# EAGLE design analog-frontend (EAGLE 6.6.0)
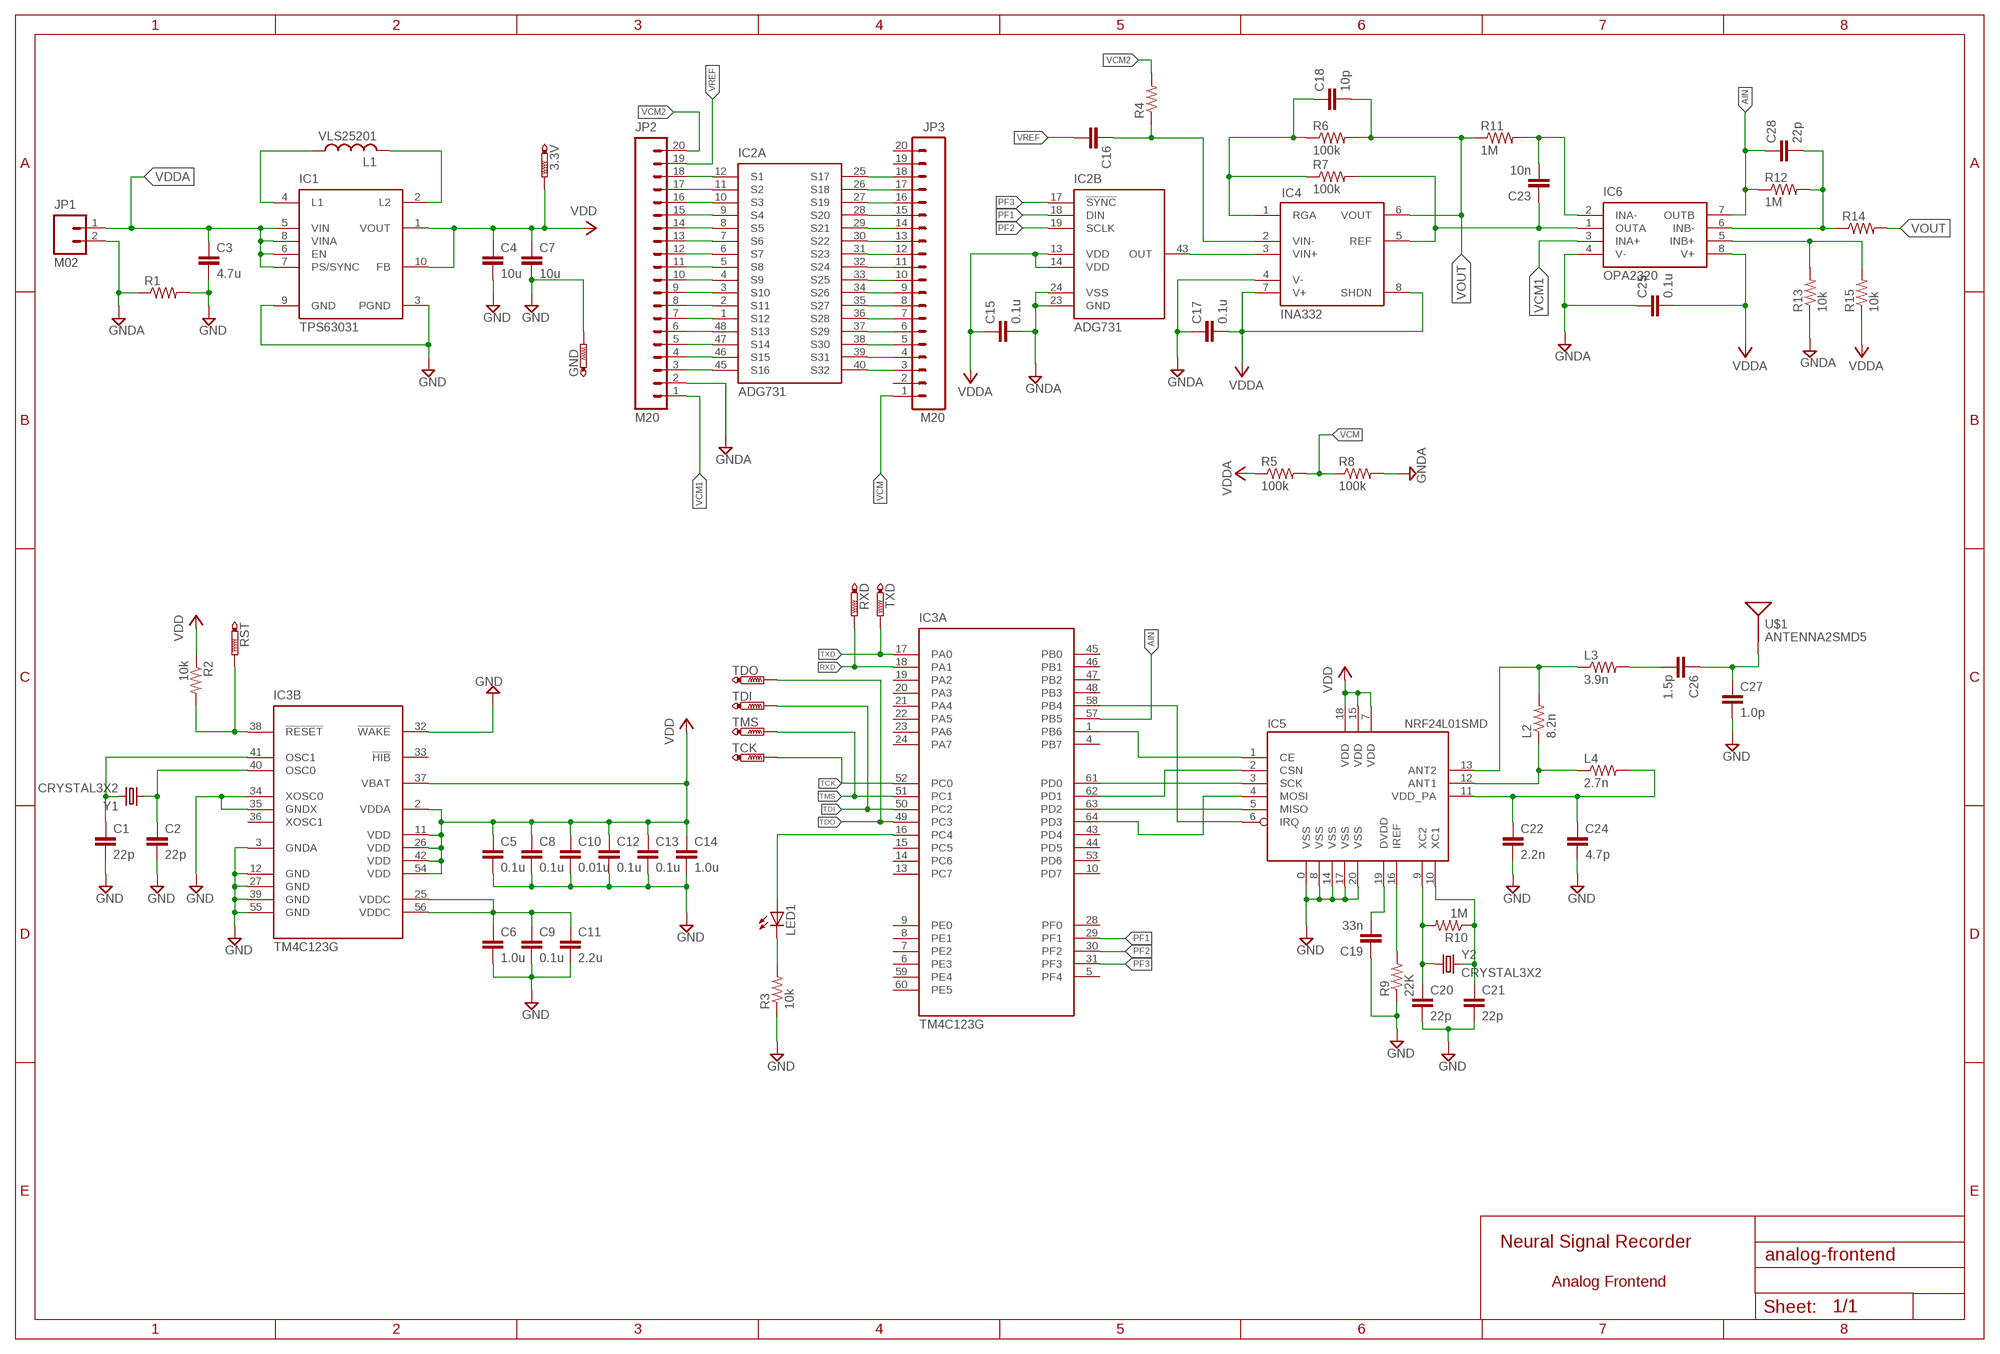
[diagram p0: schematic, sheet 1]

## Parts
3.3V  PTR1B1,27  [B1,27]
C1  22p  C-EUC0402  [C0402]
C2  22p  C-EUC0402  [C0402]
C3  4.7u  C-EUC0402  [C0402]
C4  10u  C-EUC0402  [C0402]
C5  0.1u  C-EUC0402  [C0402]
C6  1.0u  C-EUC0402  [C0402]
C7  10u  C-EUC0402  [C0402]
C8  0.1u  C-EUC0402  [C0402]
C9  0.1u  C-EUC0402  [C0402]
C10  0.01u  C-EUC0402  [C0402]
C11  2.2u  C-EUC0402  [C0402]
C12  0.1u  C-EUC0402  [C0402]
C13  0.1u  C-EUC0402  [C0402]
C14  1.0u  C-EUC0402  [C0402]
C15  0.1u  C-EUC0402  [C0402]
C16  C-EUC0402  [C0402]
C17  0.1u  C-EUC0402  [C0402]
C18  10p  C-EUC0402  [C0402]
C19  33n  C-EUC0402  [C0402]
C20  22p  C-EUC0402  [C0402]
C21  22p  C-EUC0402  [C0402]
C22  2.2n  C-EUC0402  [C0402]
C23  10n  C-EUC0402  [C0402]
C24  4.7p  C-EUC0402  [C0402]
C25  0.1u  C-EUC0402  [C0402]
C26  1.5p  C-EUC0402  [C0402]
C27  1.0p  C-EUC0402  [C0402]
C28  22p  C-EUC0402  [C0402]
GND  PTR1B1,27  [B1,27]
IC1  TPS63031  [S-PDSO-N10]
IC2  ADG731  [LFCSP48]
IC3  TM4C123G  [LQFP64]
IC4  INA332  [DGK_S-PDSO-G8]
IC5  NRF24L01SMD  [QFN20]
IC6  OPA2320  [MSOP08]
JP1  M02  [1X02]
JP2  M20  [1X20]
JP3  M20  [1X20]
L1  VLS25201  [L1008]
L2  8.2n  R-US_R0402  [R0402]
L3  3.9n  R-US_R0402  [R0402]
L4  2.7n  R-US_R0402  [R0402]
LED1  LED0402  [0402]
R1  R-US_R0201  [R0201]
R2  10k  R-US_R0402  [R0402]
R3  10k  R-US_R0402  [R0402]
R4  R-US_R0402  [R0402]
R5  100k  R-US_R0402  [R0402]
R6  100k  R-US_R0402  [R0402]
R7  100k  R-US_R0402  [R0402]
R8  100k  R-US_R0402  [R0402]
R9  22K  R-US_R0402  [R0402]
R10  1M  R-US_R0402  [R0402]
R11  1M  R-US_R0402  [R0402]
R12  1M  R-US_R0402  [R0402]
R13  10k  R-US_R0402  [R0402]
R14  R-US_R0402  [R0402]
R15  10k  R-US_R0402  [R0402]
RST  PTR1B1,27  [B1,27]
RXD  PTR1B1,27  [B1,27]
TCK  PTR1B1,27  [B1,27]
TDI  PTR1B1,27  [B1,27]
TDO  PTR1B1,27  [B1,27]
TMS  PTR1B1,27  [B1,27]
TXD  PTR1B1,27  [B1,27]
U$1  ANTENNA2SMD5  [ANTENNA-CHIP5]
Y1  CRYSTAL3X2  [SMDCRYSTAL3X2]
Y2  CRYSTAL3X2  [SMDCRYSTAL3X2]

## Nets
+3V3 [power]: 3.3V.TP C4.1 C5.1 C7.1 C8.1 C10.1 C12.1 C13.1 C14.1 IC1.1(VOUT) IC1.10(FB) IC3.2(VDDA) IC3.11(VDD) IC3.26(VDD) IC3.37(VBAT) IC3.42(VDD) IC3.54(VDD) IC5.7(VDD) IC5.15(VDD) IC5.18(VDD) R2.1 ; supply symbol labelled VDD
AIN: C28.1 IC3.57(PB5) IC6.7(OUTB) R12.1
GND [power]: C1.2 C2.2 C3.2 C4.2 C5.2 C6.2 C7.2 C8.2 C9.2 C10.2 C11.2 C12.2 C13.2 C14.2 C19.1 C20.2 C21.2 C22.2 C24.2 C27.2 GND.TP IC1.3(PGND) IC1.9(GND) IC3.3(GNDA) IC3.12(GND) IC3.27(GND) IC3.32(!WAKE!) IC3.34(XOSC0) IC3.35(GNDX) IC3.39(GND) IC3.55(GND) IC5.0(VSS) IC5.8(VSS) IC5.14(VSS) IC5.17(VSS) IC5.20(VSS) R1.2 R3.1 R9.1
GNDA [power]: C15.2 C17.1 C25.1 IC2.23(B:GND) IC2.24(B:VSS) IC4.4(V-) IC6.4(V-) JP1.2 JP2.2 R1.1 R8.2 R13.1
N$1: IC2.12(A:S1) JP2.18
N$2: IC2.45(A:S16) JP2.3
N$3: IC2.25(A:S17) JP3.18
N$4: IC2.40(A:S32) JP3.3
N$5: IC2.11(A:S2) JP2.17
N$6: IC2.10(A:S3) JP2.16
N$7: IC2.9(A:S4) JP2.15
N$8: IC2.8(A:S5) JP2.14
N$9: IC2.7(A:S6) JP2.13
N$10: IC2.6(A:S7) JP2.12
N$11: IC2.5(A:S8) JP2.11
N$12: IC2.4(A:S9) JP2.10
N$13: IC2.3(A:S10) JP2.9
N$14: IC2.2(A:S11) JP2.8
N$15: IC2.1(A:S12) JP2.7
N$16: IC2.48(A:S13) JP2.6
N$17: IC2.47(A:S14) JP2.5
N$18: IC2.46(A:S15) JP2.4
N$19: IC2.26(A:S18) JP3.17
N$20: IC2.27(A:S19) JP3.16
N$21: IC2.28(A:S20) JP3.15
N$22: IC2.29(A:S21) JP3.14
N$23: IC2.30(A:S22) JP3.13
N$24: IC2.31(A:S23) JP3.12
N$25: IC2.32(A:S24) JP3.11
N$26: IC2.33(A:S25) JP3.10
N$27: IC2.34(A:S26) JP3.9
N$28: IC2.35(A:S27) JP3.8
N$29: IC2.36(A:S28) JP3.7
N$30: IC2.37(A:S29) JP3.6
N$31: IC2.38(A:S30) JP3.5
N$32: IC2.39(A:S31) JP3.4
N$33: IC1.4(L1) L1.P$1
N$34: IC1.2(L2) L1.P$2
N$35: IC2.43(B:OUT) IC4.3(VIN+)
N$36: C23.1 IC4.5(REF) IC6.1(OUTA) R7.2
N$37: C2.1 IC3.40(OSC0) Y1.1
N$38: C18.1 IC4.1(RGA) R6.1 R7.1
N$39: C28.2 IC6.6(INB-) R12.2 R14.1
N$40: C1.1 IC3.41(OSC1) Y1.3
N$42: C23.2 IC6.2(INA-) R11.2
N$43: C19.2 IC5.19(DVDD)
N$44: IC5.16(IREF) R9.2
N$45: C6.1 C9.1 C11.1 IC3.25(VDDC) IC3.56(VDDC)
N$46: C20.1 IC5.9(XC2) R10.2 Y2.1
N$47: IC6.5(INB+) R13.2 R15.2
N$48: C21.1 IC5.10(XC1) R10.1 Y2.3
N$49: IC3.38(!RESET!) R2.2 RST.TP
N$50: IC5.12(ANT1) L2.1 L4.1
N$51: IC5.13(ANT2) L2.2 L3.1
N$52: C22.1 C24.1 IC5.11(VDD_PA) L4.2
N$53: C26.2 L3.2
N$54: C26.1 C27.1 U$1.FEED(SIGNAL)
N$55: IC3.61(PD0) IC5.3(SCK)
N$56: IC3.62(PD1) IC5.2(CSN)
N$58: IC3.63(PD2) IC5.5(MISO)
N$59: IC3.1(PB6) IC5.1(CE)
N$60: IC3.58(PB4) IC5.6(IRQ)
N$61: IC3.64(PD3) IC5.4(MOSI)
N$62: C16.1 IC4.2(VIN-) R4.1
N$63: IC3.16(PC4) LED1.1(A)
N$66: LED1.2(C) R3.2
PF1: IC2.18(B:DIN) IC3.29(PF1)
PF2: IC2.19(B:SCLK) IC3.30(PF2)
PF3: IC2.17(B:!SYNC!) IC3.31(PF3)
RXD: IC3.18(PA1) RXD.TP
TCK: IC3.52(PC0) TCK.TP
TDI: IC3.50(PC2) TDI.TP
TDO: IC3.49(PC3) TDO.TP
TMS: IC3.51(PC1) TMS.TP
TXD: IC3.17(PA0) TXD.TP
VCM: JP3.1 R5.2 R8.1
VCM1: IC6.3(INA+) JP2.1
VCM2: JP2.20 R4.2
VDDA [power]: C3.1 C15.1 C17.2 C25.2 IC1.5(VIN) IC1.6(EN) IC1.7(PS/SYNC) IC1.8(VINA) IC2.13(B:VDD) IC2.14(B:VDD) IC4.7(V+) IC4.8(SHDN) IC6.8(V+) JP1.1 R5.1 R15.1
VOUT: C18.2 IC4.6(VOUT) R6.2 R11.1 R14.2
VREF: C16.2 JP2.19
Unconnected: IC3.4(PB7) IC3.5(PF4) IC3.6(PE3) IC3.7(PE2) IC3.8(PE1) IC3.9(PE0) IC3.10(PD7) IC3.13(PC7) IC3.14(PC6) IC3.15(PC5) IC3.19(PA2) IC3.20(PA3) IC3.21(PA4) IC3.22(PA5) IC3.23(PA6) IC3.24(PA7) IC3.28(PF0) IC3.33(!HIB!) IC3.36(XOSC1) IC3.43(PD4) IC3.44(PD5) IC3.45(PB0) IC3.46(PB1) IC3.47(PB2) IC3.48(PB3) IC3.53(PD6) IC3.59(PE4) IC3.60(PE5) JP3.2 JP3.19 JP3.20

## Notes on the sheet
- Neural Signal Recorder
- Analog Frontend

## Library data of the parts
3.3V GND RST RXD TCK TDI TDO TMS TXD = testpad:PTR1: TEST PIN
C1-C28 = rcl:C-EU: CAPACITOR, European symbol
IC1 = mor307:TPS63031: Texas Instruments TPS63031 Buck/Boost Regulator
IC2 = mor307:ADG731: Analog Devices ADG731 32-channel, serially controlled analog multiplexer
IC3 = mor307:TM4C123G: Texas Instruments Tiva TM4C123G ARM Cortex-M4 Microcontroller
IC4 = mor307:INA332: Texas Instruments INA2332 Low-Power, Single Supply, CMOS Instrumentation Amplifier
IC5 = SparkFun-RF:NRF24L01: 2.4GHz Low Power Transceiver This is the very popular, low cost, very low power RF transceiver from Nordic Semiconductor. Simple SPI interface. SKU: COM-00690
IC6 = mor307:OPA2320: Texas Instruments INA2332 Low-Power, Single Supply, CMOS Instrumentation Amplifier
JP1 = mor307:M02
JP2 JP3 = mor307:M20: 1x20 .05" header
L1 = mor307:VLS25201
L2-L4 R1-R15 = rcl:R-US_: RESISTOR, American symbol
LED1 = ng:LED
U$1 = SparkFun-RF:ANTENNA2: Chip antenna Single endded antenna. Common with smaller chip antennas. CHIP4 package is the GPS Chip Antenna SKU: GPS-08418. CHIP5 package is 2.4GHz chip antenna SKU: WRL-00144.
Y1 Y2 = mor307:CRYSTAL3X2

## Net classes
1 power: width 0.203 mm

## Board
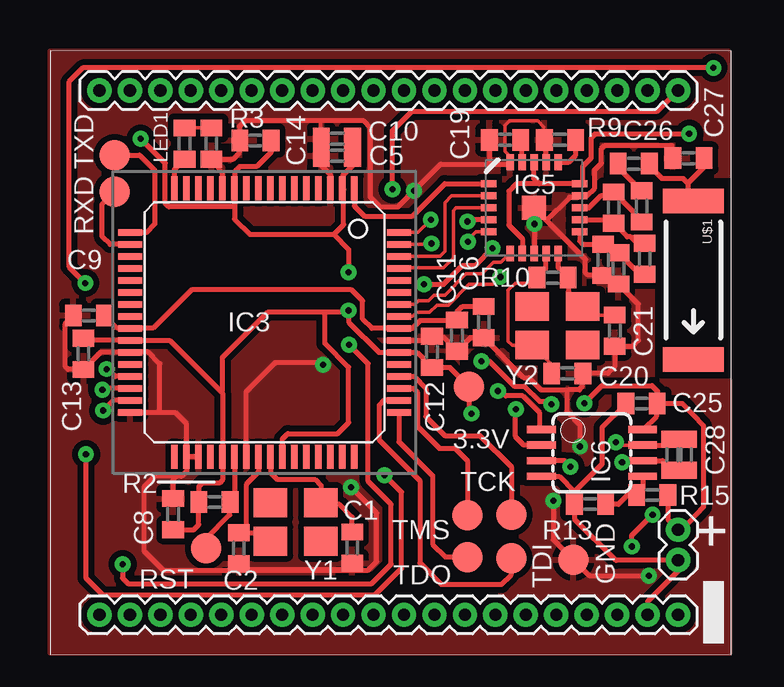
[diagram p1: board, top side]
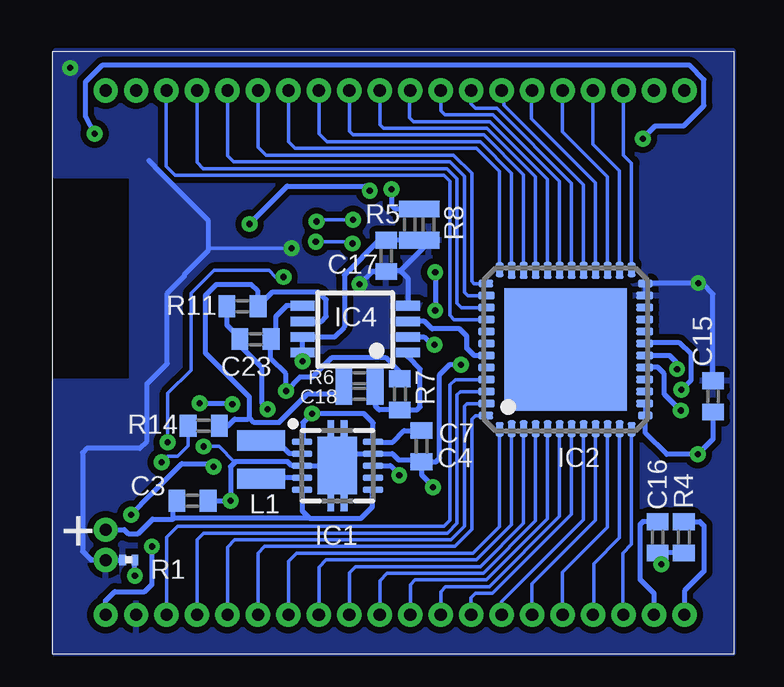
[diagram p2: board, bottom side, seen from below]

No outline drawn. Coordinates in mm, seen from the top.
Copper layers (1*16): Top 0.035mm / dielectric 1.5mm / Bottom 0.035mm
Design rules "advancedcircuits": minimum track width 8mil, minimum drill 10mil, track to track 10mil, track to pad 10mil, pad to pad 10mil, via to via 10mil, smd to smd 10mil, copper to edge 10mil, drill to drill 8mil, minimum pad ring 2.5mil, minimum via ring 2.5mil, stop-mask expansion 4mil, vias tented up to drill 0mil, thermal gap 10mil

### Footprints (pad centres in the part's own frame; a part is rotated, then mirrored left to right if it is on the bottom)
B1,27 = smd 1.27 x 1.27: TP 0,0
C0402 = smd 0.7 x 0.9: 1 -0.65,0; 2 0.65,0
S-PDSO-N10 = smd 0.28 x 0.85: 1 -1,-1.475; 2 -0.5,-1.475; 3 0,-1.475; 4 0.5,-1.475; 5 1,-1.475; 6 1,1.475; 7 0.5,1.475; 8 0,1.475; 9 -0.5,1.475; 10 -1,1.475 | smd 2.4 x 1.65: PP 0,0 | smd 3.8 x 0.28: PP@1 0,0.275; PP@2 0,-0.275
LFCSP48 = smd 0.6 x 0.32: 1 -3.325,2.75; 12 -3.325,-2.75; 25 3.325,-2.75; 36 3.325,2.75 | smd 0.7 x 0.32: 2 -3.3,2.25; 3 -3.3,1.75; 4 -3.3,1.25; 5 -3.3,0.75; 6 -3.3,0.25; 7 -3.3,-0.25; 8 -3.3,-0.75; 9 -3.3,-1.25; 10 -3.3,-1.75; 11 -3.3,-2.25; 26 3.3,-2.25; 27 3.3,-1.75; 28 3.3,-1.25; 29 3.3,-0.75; 30 3.3,-0.25; 31 3.3,0.25; 32 3.3,0.75; 33 3.3,1.25; 34 3.3,1.75; 35 3.3,2.25 | smd 0.32 x 0.6: 13 -2.75,-3.325; 24 2.75,-3.325; 37 2.75,3.325; 48 -2.75,3.325 | smd 0.32 x 0.7: 14 -2.25,-3.3; 15 -1.75,-3.3; 16 -1.25,-3.3; 17 -0.75,-3.3; 18 -0.25,-3.3; 19 0.25,-3.3; 20 0.75,-3.3; 21 1.25,-3.3; 22 1.75,-3.3; 23 2.25,-3.3; 38 2.25,3.3; 39 1.75,3.3; 40 1.25,3.3; 41 0.75,3.3; 42 0.25,3.3; 43 -0.25,3.3; 44 -0.75,3.3; 45 -1.25,3.3; 46 -1.75,3.3; 47 -2.25,3.3 | smd 5.1 x 5.1: EXP 0,0
LQFP64 = smd 1 x 0.27: 1 -5.6,3.75; 2 -5.6,3.25; 3 -5.6,2.75; 4 -5.6,2.25; 5 -5.6,1.75; 6 -5.6,1.25; 7 -5.6,0.75; 8 -5.6,0.25; 9 -5.6,-0.25; 10 -5.6,-0.75; 11 -5.6,-1.25; 12 -5.6,-1.75; 13 -5.6,-2.25; 14 -5.6,-2.75; 15 -5.6,-3.25; 16 -5.6,-3.75; 33 5.6,-3.75; 34 5.6,-3.25; 35 5.6,-2.75; 36 5.6,-2.25; 37 5.6,-1.75; 38 5.6,-1.25; 39 5.6,-0.75; 40 5.6,-0.25; 41 5.6,0.25; 42 5.6,0.75; 43 5.6,1.25; 44 5.6,1.75; 45 5.6,2.25; 46 5.6,2.75; 47 5.6,3.25; 48 5.6,3.75 | smd 0.27 x 1: 17 -3.75,-5.6; 18 -3.25,-5.6; 19 -2.75,-5.6; 20 -2.25,-5.6; 21 -1.75,-5.6; 22 -1.25,-5.6; 23 -0.75,-5.6; 24 -0.25,-5.6; 25 0.25,-5.6; 26 0.75,-5.6; 27 1.25,-5.6; 28 1.75,-5.6; 29 2.25,-5.6; 30 2.75,-5.6; 31 3.25,-5.6; 32 3.75,-5.6; 49 3.75,5.6; 50 3.25,5.6; 51 2.75,5.6; 52 2.25,5.6; 53 1.75,5.6; 54 1.25,5.6; 55 0.75,5.6; 56 0.25,5.6; 57 -0.25,5.6; 58 -0.75,5.6; 59 -1.25,5.6; 60 -1.75,5.6; 61 -2.25,5.6; 62 -2.75,5.6; 63 -3.25,5.6; 64 -3.75,5.6
DGK_S-PDSO-G8 = smd 0.4 x 1: 1 -0.975,-2.2; 2 -0.325,-2.2; 3 0.325,-2.2; 4 0.975,-2.2; 5 0.975,2.2; 6 0.325,2.2; 7 -0.325,2.2; 8 -0.975,2.2
QFN20 = smd 1 x 1: 0 0,0 | smd 0.65 x 0.3: 1 -1.9,1; 2 -1.9,0.5; 3 -1.9,0; 4 -1.9,-0.5; 5 -1.9,-1; 11 1.9,-1; 12 1.9,-0.5; 13 1.9,0; 14 1.9,0.5; 15 1.9,1 | smd 0.3 x 0.65: 6 -1,-1.9; 7 -0.5,-1.9; 8 0,-1.9; 9 0.5,-1.9; 10 1,-1.9; 16 1,1.9; 17 0.5,1.9; 18 0,1.9; 19 -0.5,1.9; 20 -1,1.9
MSOP08 = smd 1.2 x 0.3: 1 -2.113,0.976; 2 -2.113,0.326; 3 -2.113,-0.324; 4 -2.113,-0.974; 5 2.112,-0.974; 6 2.112,-0.324; 7 2.112,0.326; 8 2.112,0.976
1X02 = drill 0.508 pad 1.016: 1 -1.27,0; 2 0,0
1X20 = drill 0.508 pad 1.016: 1 0,0; 2 1.27,0; 3 2.54,0; 4 3.81,0; 5 5.08,0; 6 6.35,0; 7 7.62,0; 8 8.89,0; 9 10.16,0; 10 11.43,0; 11 12.7,0; 12 13.97,0; 13 15.24,0; 14 16.51,0; 15 17.78,0; 16 19.05,0; 17 20.32,0; 18 21.59,0; 19 22.86,0; 20 24.13,0
L1008 = smd 0.85 x 2: P$1 -0.8,0; P$2 0.8,0
R0402 = smd 0.7 x 0.9: 1 -0.65,0; 2 0.65,0
0402 = smd 0.7 x 0.9: 1 -0.65,0; 2 0.65,0
R0201 = smd 0.28 x 0.43: 1 -0.255,0; 2 0.255,0
ANTENNA-CHIP5 = smd 1.016 x 2.54: FEED -3.302,0; NC 3.302,0
SMDCRYSTAL3X2 = smd 1.4 x 1.2: 1 -1.05,-0.8; 2 1.05,-0.8; 3 1.05,0.8; 5 -1.05,0.8

### Placement (x,y rotation side)
3.3V  17.48,11.15 0 top
C1  12.6,4.45 270 top
C2  7.87,4.42 270 top
C3  22.57,6.4 0 bottom
C4  13,8.67 270 bottom
C5  11.96,20.78 180 top
C6  18.08,13.84 270 top
C7  13.02,8.67 270 bottom
C8  5.13,5.84 90 top
C9  1.63,14.12 180 top
C10  11.96,21.49 180 top
C11  16.97,13.28 270 top
C12  15.93,12.6 90 top
C13  1.4,12.52 270 top
C14  8.56,21.41 180 top
C15  0.86,10.74 90 bottom
C16  3.17,4.88 90 bottom
C17  14.49,16.6 90 bottom
C18  15.61,10.86 180 bottom
C19  18.97,21.44 0 top
C20  21.56,11.71 0 top
C21  23.55,13.49 270 top
C22  23.7,16.08 270 top
C23  19.94,13.13 180 bottom
C24  23.06,16.43 270 top
C25  24.66,10.45 0 top
C26  24.33,20.45 180 top
C27  26.62,20.68 180 top
C28  26.52,8.32 270 top
GND  21.82,3.94 0 top
IC1  16.52,7.86 270 bottom
IC2  7.01,12.7 90 bottom
IC3  8.94,13.83 270 top
IC4  15.79,13.55 90 bottom
IC5  20.18,18.61 0 top
IC6  22.59,8.39 0 top
JP1  26.19,3.92 270 top
JP2  26.19,1.65 180 top
JP3  26.19,23.5 180 top
L1  19.7,8.12 90 bottom
L2  23.5,18.62 90 top
L3  24.66,18.67 90 top
L4  24.79,16.48 270 top
LED1  5.61,21.29 90 top
R1  25.22,3.94 0 bottom
R2  6.86,6.35 0 top
R3  6.73,21.29 90 top
R4  2.08,4.88 90 bottom
R5  13.51,17.91 90 bottom
R6  15.61,11.51 180 bottom
R7  13.92,10.83 90 bottom
R8  12.73,17.91 270 bottom
R9  21.26,21.44 0 top
R10  20.95,15.7 180 top
R11  20.49,14.5 180 bottom
R12  25.95,8.32 270 top
R13  22.52,6.26 0 top
R14  22.1,9.53 0 bottom
R15  25.11,6.64 180 top
RST  6.5,4.42 0 top
RXD  2.69,19.28 0 top
TCK  19.23,5.82 0 top
TDI  19.23,4.01 0 top
TDO  17.4,4.04 0 top
TMS  17.4,5.79 0 top
TXD  2.69,20.8 0 top
U$1  26.82,15.6 270 top
Y1  10.24,5.51 0 top
Y2  21.16,13.69 0 top

### Tracks (layer width: path | path; a pad name or v marks a point on that pad's centre or on a via)
+3V3  (via drill 0.25 pad 0.66)
  Top 0.152: IC3.11 | 12.21,19.45 IC3.2
  Top 0.203: 7.19,10.87 4.98,13.08 IC3.26 1.49,13.08 C13.1 | 7.19,10.87 IC3.37 7.19,7.27 7.06,7.14 6.35,7.14 6.2,6.99 6.2,6.36 R2.1 6.2,6.34 6.2,5.41 5.98,5.19 C8.1 | IC3.11 7.69,18.64 | 7.69,18.64 7.69,18.14 8.33,17.5 11.81,17.5 | 11.81,17.5 11.84,17.5 12.24,17.91 12.24,19.38 IC3.2 | 11.81,17.5 12.45,16.87 v12.45,15.93 | IC3.54 | IC5.15 20.4,19.61 20.17,19.84 20.17,20.49 IC5.18 | IC5.15 19.43,19.61 19.13,19.3 19.13,17.88 19.68,17.32 IC5.7 | v17.58,10.03 17.48,10.13 3.3V.TP 16.68,11.95 C12.1 15.29,12.58 IC3.54 | 7.19,10.87 7.19,12.37 9.09,14.28 11.46,14.28 | 11.46,14.28 12.39,14.28 v12.45,14.33 12.45,13.84 13.71,12.58 IC3.54 | 14.52,12.6 IC3.54 | IC3.42 9.69,8.98 9.91,9.2 11.99,9.2 12.45,9.65 12.45,11.96 11.46,12.95 11.46,14.28 | 7.69,18.64 4.95,18.64 4.8,18.8 4.8,20.47 v3.79,21.49 | 22.17,19.61 IC5.15 | C14.1 9.21,20.92 8.61,20.32 7.9,20.32 7.7,20.12 IC3.11 | 12.21,19.45 12.21,19.96 12.62,20.37 12.62,20.89 C5.1 C10.1 | v26.64,21.69 22.73,21.69 22.55,21.51 22.55,20.68 22.2,20.32 22.2,19.73 IC5.15
  Bottom 0.203: 15.03,8.85 IC1.10 | 15.03,8.85 15.03,9.65 15.42,10.03 v17.58,10.03 17.96,9.65 17.96,8.9 IC1.1 | v12.45,15.93 v12.45,14.33 | v3.79,21.49 3.79,21.51 3.28,22.02 2.08,22.02 1.25,22.86 1.25,23.95 1.83,24.54 26.34,24.54 27.03,23.85 27.03,22.4 v26.64,21.69 | 15.03,8.85 14.21,8.85 13.74,9.32 C7.1 C4.1
AIN  (via drill 0.25 pad 0.66)
  Top 0.152: IC6.7 26.21,8.72 | IC6.7 26.07,8.72 26.24,8.89 26.24,9.14 26.21,9.17 | IC6.7 23.71,8.72 v23.6,8.84 | IC3.57 15.12,14.08 15.29,14.25 15.82,14.25 16.13,14.55 16.61,14.55 17.48,15.42 18.47,15.42 v18.77,15.72
  Top 0.203: IC6.7 25.7,8.72 R12.1 25.94,8.97 25.91,8.94 26.49,8.94 C28.1
  Bottom 0.152: v23.6,8.84 23.6,10.87 22.63,11.84 22.63,15.04 21.67,16 19.38,16 19.1,15.72 v18.77,15.72
GND  (via drill 0.25 pad 0.66)
  Top 0.152: IC3.12 | 11.71,19.45 IC3.3 11.69,20.01 11.2,20.5 11.2,21.18 11.28,21.26 11.28,22.23 | IC3.35 | IC5.17 | IC5.20 19.18,20.75 18.97,20.95 18.97,22.05 19.15,22.23 20.34,22.23 20.6,21.97 | 20.6,21.42 R9.1
  Top 0.203: 16.96,12.62 C11.2 | v20.98,6.4 20.98,4.78 GND.TP | v24.97,3.28 22.48,3.28 GND.TP | IC3.27 | IC5.14 | IC3.34 5.69,9.6 5.21,10.08 IC3.32 4.57,10.08 4.57,12.12 4.09,12.6 3.36,12.6 IC3.27 | IC3.35 IC3.34 | GND.TP 22.05,4.22 | IC3.34 | IC3.39 8.18,8.24 8.18,10.95 9.4,12.17 11.28,12.17 v11.38,12.06 | 8.56,3.53 12.22,3.53 12.45,3.76 12.56,3.76 C1.2 | 8.56,3.53 8.31,3.53 8.07,3.77 C2.2 | 18.44,20.42 16.28,20.42 v15.18,19.32 14.5,18.64 13.77,18.64 13.36,19.05 13.36,21.95 13.08,22.23 11.28,22.23 8.13,22.23 7.9,22 7.9,21.42 C14.2 7.9,20.9 7.63,20.64 R3.1 7.19,20.05 IC3.12 | 18.44,20.42 19.13,20.42 IC5.20 | 20.7,18.09 IC5.0 20.19,18.49 v20.19,17.93 20.19,16.71 IC5.8 | 20.7,18.09 21.67,19.05 22.02,19.05 IC5.14 | 12.88,6.63 v12.55,6.96 13.61,5.89 13.61,3.86 13.26,3.5 8.53,3.5 | v22.1,8.66 22.1,9.55 21.57,10.08 21.57,10.97 | 11.71,19.45 11.71,19.96 11.3,20.37 11.3,20.89 C5.2 C10.2 | C11.2 17.53,13.19 C6.2 19.75,11.53 19.96,11.53 20.47,11.02 21.51,11.02 21.57,10.97 | IC3.55 15.76,13.08 C12.2 16.35,13.25 C11.2 | IC3.34 5.69,7.62 5.49,7.42 5.28,7.42 | 5.28,7.42 4.37,7.42 3.91,6.96 3.91,4.32 4.72,3.5 8.53,3.5 | 8.53,3.5 8.56,3.53 | C8.2 5.13,7.26 5.28,7.42 | IC3.35 IC3.34 | C19.1 18.32,20.54 18.44,20.42 | IC5.17 20.68,21.34 R9.1 | IC5.14 22.38,19.11 22.71,19.43 22.71,20.19 22.99,20.47 22.99,21.08 23.11,21.21 25.91,21.21 25.93,21.18 25.93,20.71 C27.2 | 20.7,18.09 22.33,16.46 22.33,15.9 22.43,15.8 23.05,15.8 C24.2 23.34,15.78 C22.2 24.54,14.59 24.54,13.08 24.29,12.84 C21.2 23.55,11.99 23.27,11.71 C20.2 22.17,11.69 22.17,11.15 22.07,11.05 22.07,11.02 21.61,11.02 21.57,10.97 | IC3.27 2.1,12.58 C13.2 0.75,11.87 0.64,11.99 0.64,13.78 C9.2
  Bottom 0.152: 20.78,8.03 20.83,8.03 21.46,8.66 v22.1,8.66
  Bottom 0.203: v24.97,3.28 R1.2 | v15.18,19.32 15.37,19.51 18.62,19.51 v20.19,17.93 | C3.2 v20.98,6.4 20.98,7.82 20.78,8.03 18.59,8.03 18.43,7.86 IC1.3 16.8,7.86 16.31,8.36 IC1.9 14.23,8.36 13.97,8.1 13.1,8.1 C7.2 | v12.55,6.96 12.55,7.01 13.01,7.47 C4.2 C7.2 | v11.38,12.06 11.86,12.06 12.27,11.66 12.27,8.18 12.42,8.02 C4.2 C7.2
  pour Top (isolate 0.152): 0,25.15 28.3,25.15 28.3,19.94 25.12,19.94 25.12,11.4 28.35,11.4 28.35,0.05 0,0.05
GNDA  (via drill 0.25 pad 0.64, 0.25 pad 0.66)
  Top 0.203: JP2.2 24.92,2.21 26.19,3.48 JP1.2 26.18,3.91 23.6,3.91 21.87,5.64 R13.1 | v15.6,15.42 16.41,15.42 17.2,16.2 17.75,16.2 v18.44,16.92 | C25.1 23.02,9.46 23.02,7.93 21.87,6.78 | IC6.4 21.23,7.42 21.87,6.78 | 21.87,6.78 R13.1 | R13.1 | v27.66,24.43 1.37,24.43 0.79,23.85 0.79,16.15 v1.47,15.47
  Bottom 0.152: v18.44,16.92 21.82,16.92 21.92,16.82
  Bottom 0.203: R1.1 25.49,3.92 JP1.2 26.2,3.94 26.8,3.94 27.15,4.29 27.15,8.41 26.98,8.59 24.77,8.59 24.46,8.89 24.46,11.28 23.62,12.12 23.62,15.04 22.91,15.75 22.91,15.82 21.92,16.82 21.92,18.09 24.11,20.27 24.11,20.3 24.38,20.57 | IC2.23 3.69,14.97 IC2.24 3.67,15.47 v1.47,15.47 1.32,15.47 0.86,15.01 C15.2 | IC4.4 13.59,15.67 13.89,15.98 | 13.89,15.98 14.46,15.98 C17.1 15.06,15.95 v15.6,15.42 | R8.2 12.72,17.14 13.89,15.98
  pour Bottom (isolate 0.152): 0,25.15 28.3,25.15 28.3,19.94 25.12,19.94 25.12,11.38 28.35,11.38 28.35,0.05 0,0.05
N$1
  Bottom 0.152: IC2.12 4.26,4.58 4.62,4.22 4.62,1.68 JP2.18
N$2
  Bottom 0.152: IC2.45 11.61,11.45 11.84,11.23 11.84,5.59 12.09,5.33 23.19,5.33 23.65,4.88 JP2.3
N$3
  Bottom 0.152: IC2.25 4.26,20.47 4.6,20.8 JP3.18
N$4
  Bottom 0.152: IC2.40 11.66,13.95 11.84,14.12 11.84,19.71 12.09,19.96 23.29,19.96 23.67,20.34 23.67,23.47 JP3.3
N$5
  Bottom 0.152: IC2.11 4.76,4.87 5.84,3.79 5.84,1.68 JP2.17
N$6
  Bottom 0.152: IC2.10 5.26,5.31 7.14,3.43 JP2.16
N$7
  Bottom 0.152: IC2.9 5.76,5.59 8.41,2.95 JP2.15
N$8
  Bottom 0.152: IC2.8 6.26,5.6 9.68,2.18 JP2.14
N$9
  Bottom 0.152: IC2.7 6.76,5.84 10.06,2.54 10.77,2.54 10.95,2.36 JP2.13
N$10
  Bottom 0.152: IC2.6 7.26,5.74 10.19,2.82 12.01,2.82 12.22,2.62 JP2.12
N$11
  Bottom 0.152: IC2.5 7.76,5.65 10.31,3.1 13.28,3.1 13.49,2.9 JP2.11
N$12
  Bottom 0.152: IC2.4 8.26,5.56 10.44,3.38 14.45,3.38 14.76,3.07 JP2.10
N$13
  Bottom 0.152: IC2.3 8.76,5.46 10.57,3.66 15.77,3.66 16.03,3.4 JP2.9
N$14
  Bottom 0.152: IC2.2 9.26,5.39 10.72,3.94 16.99,3.94 17.3,3.63 JP2.8
N$15
  Bottom 0.152: IC2.1 9.76,5.33 10.87,4.22 18.24,4.22 18.57,3.89 JP2.7
N$16
  Bottom 0.152: IC2.48 10.78,9.95 10.92,9.8 10.92,5.21 11.63,4.5 19.56,4.5 19.84,4.22 JP2.6
N$17
  Bottom 0.152: IC2.47 11.12,10.45 11.23,10.34 11.23,5.33 11.79,4.78 20.8,4.78 21.11,4.47 JP2.5
N$18
  Bottom 0.152: IC2.46 11.4,10.95 11.53,10.82 11.53,5.46 11.94,5.05 22.1,5.05 22.38,4.78 JP2.4
N$19
  Bottom 0.152: IC2.26 4.76,20.15 5.87,21.26 JP3.17
N$20
  Bottom 0.152: IC2.27 5.26,19.89 7.14,21.77 JP3.16
N$21
  Bottom 0.152: IC2.28 5.76,19.65 8.43,22.33 8.43,23.47 JP3.15
N$22
  Bottom 0.152: IC2.29 6.26,19.57 9.58,22.89 9.58,23.39 JP3.14
N$23
  Bottom 0.152: IC2.30 6.76,19.64 9.88,22.76 10.77,22.76 10.95,22.94 JP3.13
N$24
  Bottom 0.152: IC2.31 7.26,19.71 10.03,22.48 12.04,22.48 12.22,22.66 JP3.12
N$25
  Bottom 0.152: IC2.32 7.76,19.8 10.16,22.2 13.36,22.2 13.51,22.35 13.51,23.47 JP3.11
N$26
  Bottom 0.152: IC2.33 8.26,19.89 10.29,21.92 14.61,21.92 14.76,22.07 JP3.10
N$27
  Bottom 0.152: IC2.34 8.76,19.99 10.41,21.64 15.88,21.64 16.03,21.79 JP3.9
N$28
  Bottom 0.152: IC2.35 9.26,20.05 10.57,21.36 16.97,21.36 17.3,21.69 JP3.8
N$29
  Bottom 0.152: IC2.36 9.76,20.12 10.72,21.08 18.29,21.08 18.57,21.36 JP3.7
N$30
  Bottom 0.152: IC2.37 10.83,15.45 10.92,15.54 10.92,20.04 11.68,20.8 19.51,20.8 19.84,21.13 JP3.6
N$31
  Bottom 0.152: IC2.38 11.09,14.95 11.23,15.09 11.23,19.91 11.84,20.52 20.85,20.52 21.11,20.78 JP3.5
N$32
  Bottom 0.152: IC2.39 11.35,14.45 11.53,14.63 11.53,19.81 11.96,20.24 22.12,20.24 22.38,20.5 JP3.4
N$33
  Bottom 0.203: IC1.4 19.65,7.36 L1.P$1
N$34
  Bottom 0.203: IC1.2 18.52,8.36 19.07,8.91 L1.P$2 | L1.P$2
N$35
  Bottom 0.203: 13.58,13.87 IC4.3 12.88,13.88 12.57,13.56 11.43,13.56 11.12,13.26 11.12,12.75 10.82,12.45 IC2.43
N$36  (via drill 0.25 pad 0.66)
  Top 0.203: v18.67,10.97 19,10.77 19.71,10.77 20.4,10.08 20.4,9.46 IC6.1
  Bottom 0.203: IC4.5 18.65,14.53 19.1,14.07 19.1,13.32 C23.1 19.3,13.12 19.3,12.32 18.67,11.68 v18.67,10.97 18.09,11.56 17.55,11.56 16.74,12.37 14.53,12.37 13.92,11.76 R7.2
N$37
  Top 0.203: 9.13,4.77 Y1.1 8.83,5.07 C2.1 8.18,5.37 8.18,7.09 8.69,7.6 IC3.40
N$38
  Bottom 0.203: IC4.1 13.59,12.39 13.08,11.89 13.08,10.31 13.21,10.18 R7.1 14.78,10.18 14.94,10.34 14.94,10.84 C18.1 R6.1
N$39  (via drill 0.25 pad 0.66)
  Top 0.152: 26.05,7.82 R12.2 | IC6.6 24.64,8 v23.85,8
  Top 0.203: IC6.6 25.54,8.07 R12.2 C28.2
  Bottom 0.152: R14.1 22.75,8.7 23.19,8.26 23.6,8.26 v23.85,8
N$40
  Top 0.203: IC3.41 9.19,7.57 9.47,7.29 11.05,7.29 11.3,7.04 11.3,6.33 Y1.3 11.35,6.25 12.06,6.25 12.6,5.71 C1.1
N$42  (via drill 0.25 pad 0.66)
  Top 0.203: IC6.2 19.75,8.72 19.41,9.07 19.41,10.19 v19.43,10.21
  Bottom 0.203: 19.4,10.32 v19.43,10.21 19.68,10.46 19.68,11.96 20.59,12.87 C23.2 20.6,13.14 20.6,13.18 21.13,13.72 R11.2
N$43
  Top 0.152: IC5.19
  Top 0.203: IC5.19 19.68,21.36 C19.2
N$44
  Top 0.152: IC5.16
  Top 0.203: IC5.16 21.62,20.51 21.92,20.8 21.92,21.4 R9.2
N$45
  Top 0.203: IC3.25 4.29,13.59 5.89,15.19 12.57,15.19 13.03,14.73 13.03,13.97 13.42,13.58 IC3.56 15.1,13.58 15.44,13.92 16.95,13.92 C11.1 16.97,14.28 17.2,14.5 18.07,14.5 C6.1 | IC3.25 | IC3.25 2.81,13.59 C9.1
N$46
  Top 0.152: 20.65,16.67 IC5.9 | C20.1 20.89,12.11 Y2.1 20.38,12.88 19.28,12.88 19.1,13.06 19.1,15.16 19.41,15.47 20.08,15.47 R10.2
  Top 0.203: 20.65,16.67 20.65,16.04 R10.2
N$47
  Top 0.203: R13.2 23.18,6.25 23.7,6.25 24.09,6.64 R15.2 24.7,6.89 IC6.5
N$48
  Top 0.152: 22.48,14.47 Y2.3 22.56,14.14 C21.1
  Top 0.203: IC5.10 21.18,16.12 R10.1 21.61,15.09 Y2.3
N$49
  Top 0.203: IC3.38 7.69,6.53 R2.2 7.49,6.33 7.49,5.82 6.5,4.83 RST.TP
N$50
  Top 0.203: IC5.12 23.36,18.11 L2.1 24.06,17.4 24.21,17.4 24.42,17.18 L4.1
N$51
  Top 0.203: IC5.13 22.47,18.61 22.99,19.13 23.35,19.13 L2.2 24.66,18.1 L3.1
N$52
  Top 0.203: IC5.11 22.08,17.21 22.2,17.09 23.05,17.09 C24.1 23.34,17.08 C22.1 24.54,15.88 L4.2
N$53
  Top 0.203: C26.2 23.68,20.3 L3.2
N$54
  Top 0.203: C26.1 24.98,20.36 25.5,19.84 26.39,19.84 26.59,19.63 | 26.59,19.63 26.59,18.92 U$1.FEED | C27.1 27.27,20.31 26.59,19.63
N$55
  Top 0.152: IC5.3 16.93,18.61 16.82,18.49 16.82,16.51 16.41,16.1 14.56,16.1 IC3.61
N$56
  Top 0.152: IC5.2 16.74,19.11 16.46,18.82 16.46,16.79 16.26,16.59 IC3.62
N$58  (via drill 0.25 pad 0.66)
  Top 0.152: 17.81,17.61 IC5.5 17.75,17.6 17.42,17.27 v17.42,17.2 | IC3.63 15.86,17.08 v15.9,17.12
  Bottom 0.152: v17.42,17.2 15.98,17.2 v15.9,17.12
N$59
  Top 0.203: IC3.1 12.69,18.68 13.11,18.26 15.11,18.26 16.46,19.61 IC5.1
N$60
  Top 0.152: IC5.6 19.11,16.7 | IC3.58 15.21,14.58 15.37,14.73 15.77,14.73 16,14.96 16.46,14.96 17.35,15.85 18.01,15.85 18.49,16.33 18.81,16.33 IC5.6 | IC3.58
  Top 0.203: IC5.6
N$61  (via drill 0.25 pad 0.66)
  Top 0.152: IC3.64 15.35,17.58 v15.88,18.11
  Top 0.203: IC5.4 17.47,18.11 v17.4,18.03
  Bottom 0.152: v15.88,18.11 17.32,18.11 v17.4,18.03
N$62  (via drill 0.25 pad 0.66)
  Top 0.203: v3.02,3.76 3.02,3.17 3.25,2.95 13.41,2.95 14.22,3.76 14.22,6.25 13.26,7.21 13.26,12.12 v12.47,12.9
  Bottom 0.203: IC4.2 12.92,13.23 12.6,12.9 v12.47,12.9 | R4.1 C16.1 3.25,3.99 v3.02,3.76
N$63
  Top 0.203: IC3.16 5.19,20.21 LED1.1
N$66
  Top 0.152: LED1.2 R3.2
PF1  (via drill 0.25 pad 0.66)
  Top 0.203: IC3.29 2.72,11.58 v2.36,11.89
  Bottom 0.203: v2.36,11.89 2.39,12.17 2.67,12.45 IC2.18
PF2  (via drill 0.25 pad 0.66)
  Top 0.203: IC3.30 2.24,11.08 v2.18,11.02
  Bottom 0.203: IC2.19 3.68,12.98 2.26,12.98 1.78,12.5 1.78,11.43 v2.18,11.02
PF3  (via drill 0.25 pad 0.66)
  Top 0.203: IC3.31 2.63,10.58 v2.21,10.16
  Bottom 0.203: IC2.17 3.7,11.96 3.17,11.96 2.9,11.68 2.9,10.85 v2.21,10.16
RXD
  Top 0.203: IC3.18 2.5,17.08 2.18,17.4 2.18,18.77 RXD.TP
TCK
  Top 0.203: TCK.TP 19.23,7.82 17.93,9.12 16.46,9.12 15.67,9.91 15.67,11.07 15.17,11.58 IC3.52
TDI
  Top 0.203: TDI.TP 19.23,3.33 18.82,2.92 16.31,2.92 15.42,3.81 15.42,7.24 13.72,8.94 13.72,10.39 13.91,10.58 IC3.50
TDO
  Top 0.203: IC3.49 14.54,8.85 15.95,7.44 15.95,4.6 16.48,4.06 17.37,4.06 TDO.TP
TMS
  Top 0.203: TMS.TP 17.4,8.08 16.89,8.59 16.23,8.59 15.32,9.5 15.32,10.92 15.16,11.08 IC3.51
TXD
  Top 0.203: TXD.TP 3.73,20.8 4.37,20.17 4.37,17.93 4.01,17.58 IC3.17
VCM  (via drill 0.25 pad 0.66)
  Top 0.152: JP3.1 26.19,23.52 26.21,23.47
  Top 0.203: v14.28,19.38 14.28,21.82 15.09,22.63 25.32,22.63 JP3.1
  Bottom 0.203: v14.28,19.38 14.28,18.72 14.12,18.57 13.52,18.57 R5.2 R8.1
VCM1  (via drill 0.25 pad 0.66)
  Top 0.203: v21.69,7.82 21.44,8.07 IC6.3 | v24.26,4.5 24.26,4.95 v25.12,5.82
  Bottom 0.203: JP2.1 26.19,2.23 25.81,2.62 24.56,2.62 24.26,2.92 v24.26,4.5 24.26,4.62 | v25.12,5.82 24.28,6.68 23.01,7.95 21.82,7.95 v21.69,7.82
VCM2
  Bottom 0.203: R4.2 1.41,5.53 1.25,5.36 1.25,3.45 2.06,2.64 JP2.20
VDDA  (via drill 0.25 pad 0.66)
  Top 0.203: 1.52,8.36 v1.5,8.33 1.5,3.17 2.21,2.46 13.54,2.46 14.66,3.58 14.66,6.76 v13.95,7.47 14.1,7.32 | v17.98,12.22 18.31,12.22 19.36,11.18 19.79,11.18 20.42,10.54 20.78,10.54 v20.9,10.41 | C25.2 25.32,10.46 25.32,10.97 25.09,11.2 23.01,11.2 v22.28,10.46 | IC6.8 24.74,9.37 25.3,9.93 25.3,10.44 C25.2 | R15.1 25.76,5.62 JP1.1 26.35,5.19 27.25,6.15 27.25,9.53 26.39,10.44 25.33,10.44 C25.2
  Bottom 0.152: IC2.14 3.71,9.97 IC2.13
  Bottom 0.203: v1.5,8.33 2.79,8.33 3.68,9.22 IC2.13 | 17.68,5.66 15.54,5.66 15.06,6.15 15.06,6.85 IC1.6 IC1.7 IC1.8 14.31,7.86 v13.95,7.47 | v17.98,12.22 v17.99,12.22 IC4.8 IC4.7 16.64,13.23 16.23,13.64 16.23,15.8 14.78,17.25 C17.2 R5.1 | v22.28,10.46 20.95,10.46 v20.9,10.41 | 1.19,8.64 v1.5,8.33 | 23.37,5.64 23.37,6.25 C3.1 | IC1.5 18,5.98 17.68,5.66 | 17.68,5.66 23.34,5.66 23.37,5.64 | C15.1 0.86,8.97 v1.5,8.33 | JP1.1 25.41,5.19 25.25,5.03 24.84,5.03 24.23,5.64 23.37,5.64
VOUT
  Bottom 0.203: IC4.6 17.98,13.87 17.2,13.87 16.99,14.07 16.99,14.78 17.3,15.09 19.25,15.09 R11.1 19.86,14.53 19.86,15.16 20.12,15.42 21.57,15.42 22.02,14.96 22.02,12.55 20.19,10.72 20.19,9.86 | 20.19,9.86 19.99,9.65 18.97,9.65 17.77,10.86 C18.2 R6.2 | 20.19,9.86 20.24,9.8 20.8,9.8 21.08,9.53 R14.2
VREF
  Bottom 0.203: C16.2 3.79,5.53 3.91,5.41 3.91,3.12 3.33,2.54 JP2.19

### Text on the board
tNames: +
bNames: +